# EAGLE design placa (EAGLE 7.6.0)
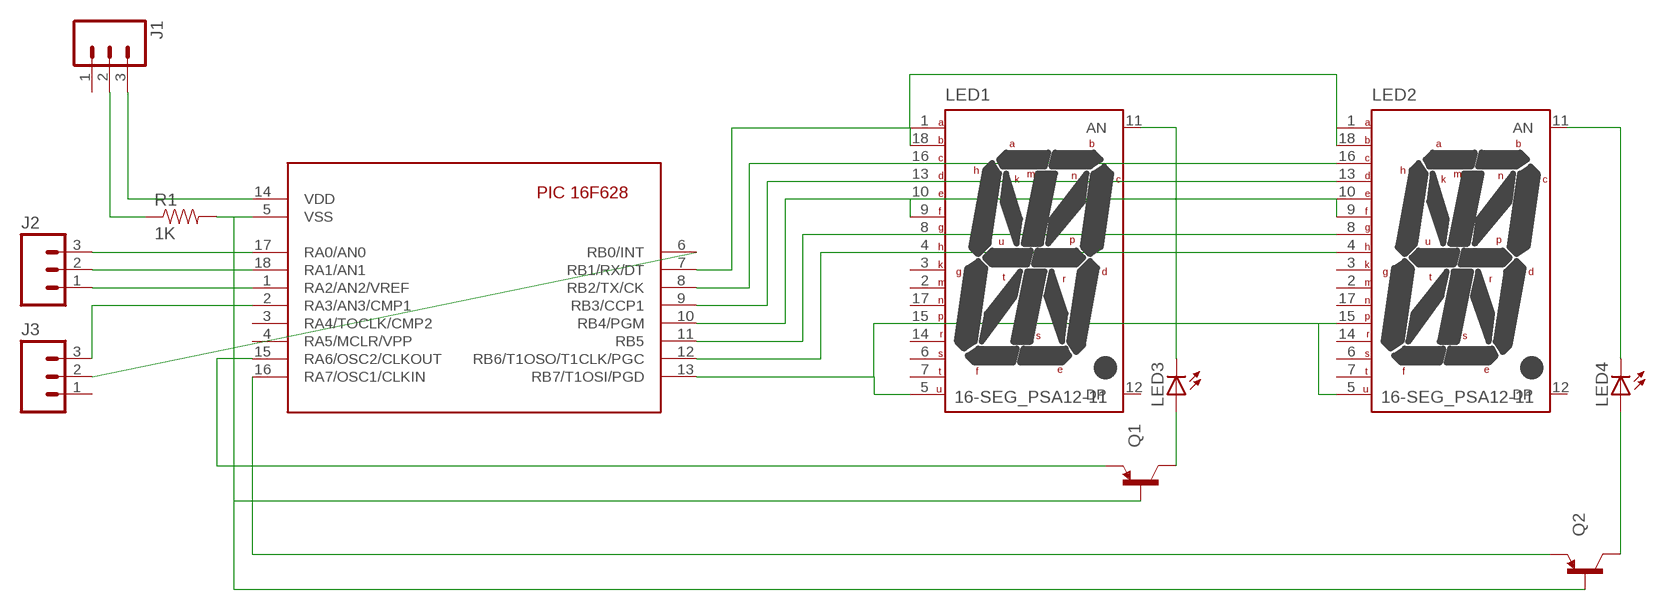
[diagram p0: schematic, sheet 1]

## Parts
J1  M03-SCREW-5MM  [SCREWTERMINAL-5MM-3]
J2  M03-SCREW-5MM  [SCREWTERMINAL-5MM-3]
J3  M03-SCREW-5MM  [SCREWTERMINAL-5MM-3]
LED1  16-SEG_PSA12-11  [PSA12-11]
LED2  16-SEG_PSA12-11  [PSA12-11]
LED3  LED3MM  [LED3MM]
LED4  LED3MM  [LED3MM]
Q1  TRANSISTOR_PNPTO92  [TO-92]
Q2  TRANSISTOR_PNPTO92  [TO-92]
R1  1K  1KOHM-1/4W-1%(PTH)  [AXIAL-0.3]
U$1  16F628  [PIC16F628-18-LEAD-PDIP]

## Nets
N$1: LED1.5(U) LED1.15(P) LED2.5(U) LED2.15(P) U$1.13(RB7/T1OSI/PGD)
N$2: LED1.1(A) LED1.18(B) LED2.1(A) LED2.18(B) U$1.7(RB1/RX/DT)
N$3: LED1.16(C) LED2.16(C) U$1.8(RB2/TX/CK)
N$4: LED1.13(D) LED2.13(D) U$1.9(RB3/CCP1)
N$5: LED1.9(F) LED1.10(E) LED2.9(F) LED2.10(E) U$1.10(RB4/PGM)
N$6: LED1.8(G) LED2.8(G) U$1.11(RB5)
N$7: LED1.4(H) LED2.4(H) U$1.12(RB6/T1OSO/T1CLK/PGC)
N$8: Q1.1(E) U$1.15(RA6/OSC2/CLKOUT)
N$9: Q2.1(E) U$1.16(RA7/OSC1/CLKIN)
N$10: J1.3 U$1.14(VDD)
N$11: J1.2 R1.P$1
N$12: Q1.2(B) Q2.2(B) R1.P$2 U$1.5(VSS)
N$13: J2.3 U$1.17(RA0/AN0)
N$14: J2.2 U$1.18(RA1/AN1)
N$15: J2.1 U$1.1(RA2/AN2/VREF)
N$16: J3.3 U$1.2(RA3/AN3/CMP1)
N$17: LED1.11(AN) LED3.K(C)
N$18: LED2.11(AN) LED4.K(C)
N$19: LED3.A Q1.3(C)
N$20: LED4.A Q2.3(C)
N$21: J3.2 U$1.6(RB0/INT)
Unconnected: J1.1 J3.1 LED1.2(M) LED1.3(K) LED1.6(S) LED1.7(T) LED1.12(DP) LED1.14(R) LED1.17(N) LED2.2(M) LED2.3(K) LED2.6(S) LED2.7(T) LED2.12(DP) LED2.14(R) LED2.17(N) U$1.3(RA4/TOCLK/CMP2) U$1.4(RA5/MCLR/VPP)

## Library data of the parts
J1-J3 = SparkFun-Connectors:M03: Header 3 Standard 3-pin 0.1" header. Use with straight break away headers (SKU : PRT-00116), right angle break away headers (PRT-00553), swiss pins (PRT-00743), machine pins (PRT-00117), and female headers (PRT-00115). Molex polarized connector foot print use with SKU : PRT-08232 with associated crimp pins and housings.; STOREFRONT_ID: PRT-08433
LED1 LED2 = display-kingbright:16-SEG_: 16 SEGMENT SINGLE DIGIT ALPHANUMERIC NUMERIC DISPLAY; OC_FARNELL: unknown; OC_NEWARK: unknown
LED3 LED4 = led:LED: LED OSRAM: - CHIPLED LG R971, LG N971, LY N971, LG Q971, LY Q971, LO R971, LY R971 LH N974, LH R974 LS Q976, LO Q976, LY Q976 LO Q996 - Hyper CHIPLED LW Q18S LB Q993, LB Q99A, LB R99A - SideLED LS A670, LO A670, LY A670, LG A670, LP A670 LB A673, LV A673, LT A673, LW A673 LH A674 LY A675 LS A676, LA A676, LO A676, LY A676, LW A676 LS A679, LY A679, LG A679 - Hyper Micro SIDELED® LS Y876, LA Y876, LO Y876, LY Y876 LT Y87S - SmartLED LW L88C, LW L88S LB L89C, LB L89S, LG L890 LS L89K, LO L89K, LY L89K LS L896, LA L896, LO L896, LY L896 - TOPLED LS T670, LO T670, LY T670, LG T670, LP T670 LSG T670, LSP T670, LSY T670, LOP T670, LYG T670 LG T671, LOG T671, LSG T671 LB T673, LV T673, LT T673, LW T673 LH T674 LS T676, LA T676, LO T676, LY T676, LB T676, LH T676, LSB T676, LW T676 LB T67C, LV T67C, LT T67C, LS T67K, LO T67K, LY T67K, LW E67C LS E67B, LA E67B, LO E67B, LY E67B, LB E67C, LV E67C, LT E67C LW T67C LS T679, LY T679, LG T679 LS T770, LO T770, LY T770, LG T770, LP T770 LB T773, LV T773, LT T773, LW T773 LH T774 LS E675, LA E675, LY E675, LS T675 LS T776, LA T776, LO T776, LY T776, LB T776 LHGB T686 LT T68C, LB T68C - Hyper Mini TOPLED® LB M676 - Mini TOPLED Santana® LG M470 LS M47K, LO M47K, LY M47K Source: http://www.osram.convergy.de LUXEON: - LUMILED® LXK2-PW12-R00, LXK2-PW12-S00, LXK2-PW14-U00, LXK2-PW14-V00 LXK2-PM12-R00, LXK2-PM12-S00, LXK2-PM14-U00 LXK2-PE12-Q00, LXK2-PE12-R00, LXK2-PE12-S00, LXK2-PE14-T00, LXK2-PE14-U00 LXK2-PB12-K00, LXK2-PB12-L00, LXK2-PB12-M00, LXK2-PB14-N00, LXK2-PB14-P00, LXK2-PB14-Q00 LXK2-PR12-L00, LXK2-PR12-M00, LXK2-PR14-Q00, LXK2-PR14-R00 LXK2-PD12-Q00, LXK2-PD12-R00, LXK2-PD12-S00 LXK2-PH12-R00, LXK2-PH12-S00 LXK2-PL12-P00, LXK2-PL12-Q00, LXK2-PL12-R00 Source: www.luxeon.com KINGBRIGHT: KA-3528ASYC Source: www.kingbright.com
Q1 Q2 = SparkFun-DiscreteSemi:TRANSISTOR_PNP: Generic PNP BJT Double check pinouts against datasheets- not all devices are the same! MMBT3906 - 40V 200mA SOT-23 (TRANS-08052) MMBT4403 - 40V 600mA SOT-23 (TRANS-09245)
R1 = SparkFun-Resistors:1KOHM-1/4W-1%(PTH): RES-12182; PROD_ID: RES-12182
U$1 = pic16f6xx-1:16F628: Microchip component PIC 16F628 Eric Magraner - eric_magraner@yahoo.fr 03/2004

## Board
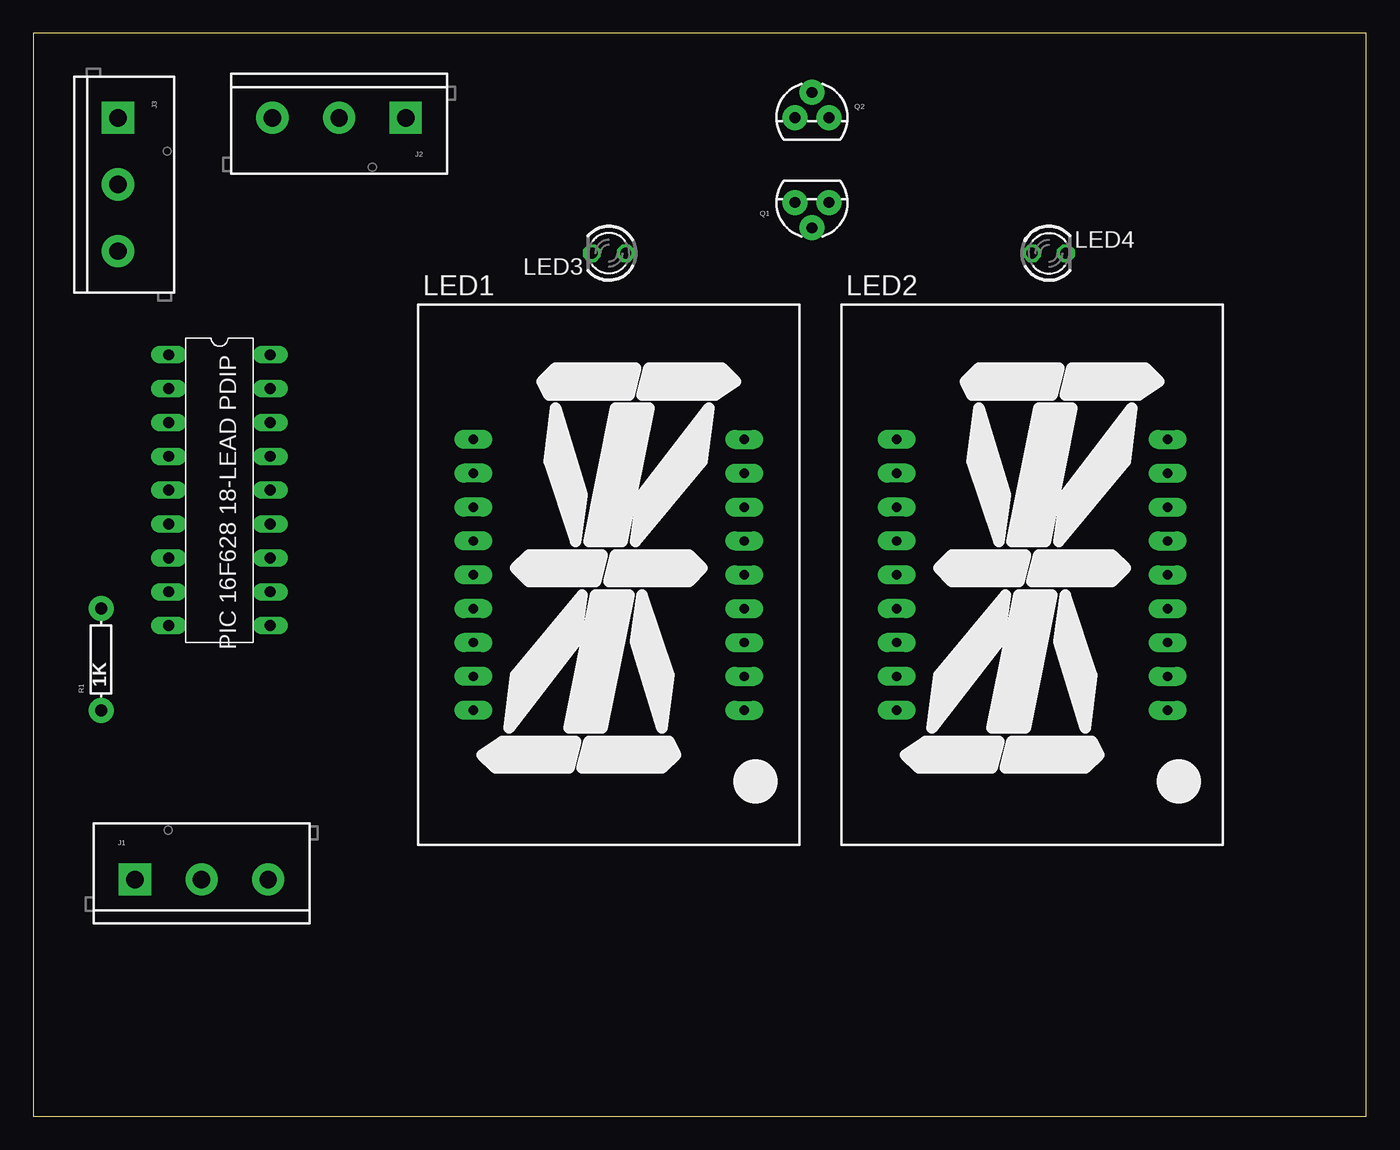
[diagram p1: board, top side]
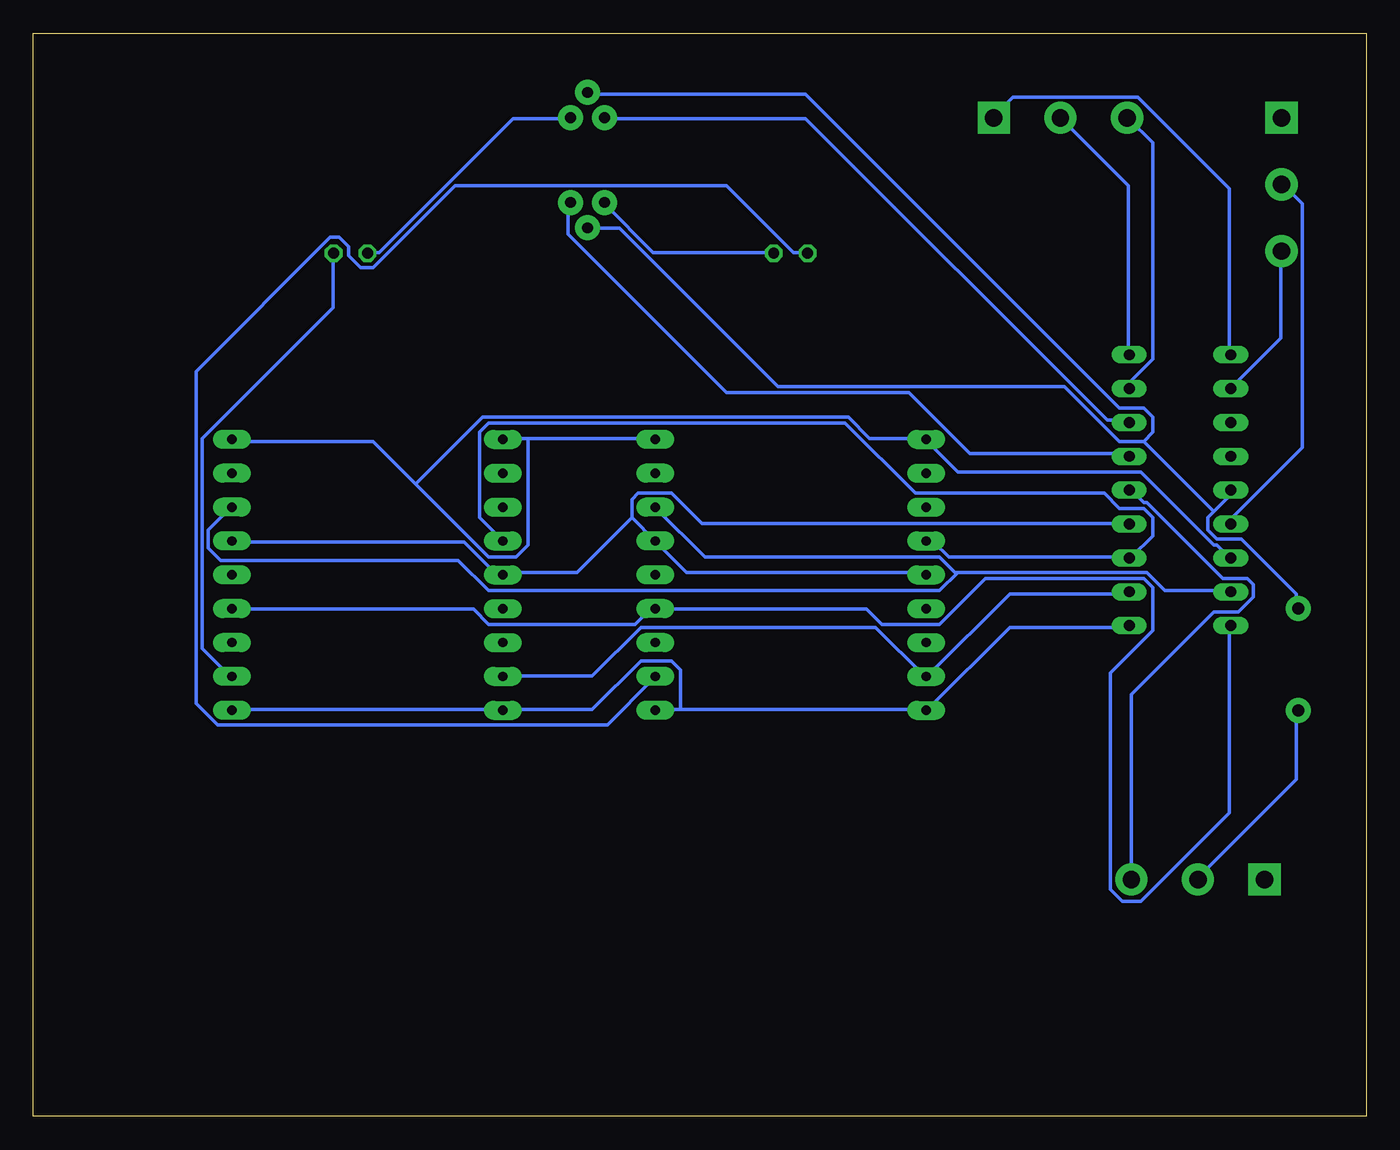
[diagram p2: board, bottom side, seen from below]

Size 100 x 81.27 mm. Coordinates in mm from the lower left corner, seen from the top.
Outline: 0,0 100,0 100,81.27 0,81.27 0,0
Copper layers (1*16): Top 0.035mm / dielectric 1.5mm / Bottom 0.035mm
Design rules "default": minimum track width 10mil, minimum drill 24mil, track to track 8mil, track to pad 8mil, pad to pad 8mil, via to via 8mil, smd to smd 8mil, copper to edge 40mil, drill to drill 8mil, minimum pad ring 10mil, minimum via ring 8mil, stop-mask expansion 4mil, vias tented up to drill 0mil, thermal gap 10mil

### Footprints (pad centres in the part's own frame; a part is rotated, then mirrored left to right if it is on the bottom)
SCREWTERMINAL-5MM-3 = drill 1.3 pad 2.413 square: 1 0,0 | drill 1.3 pad 2.413: 2 5,0; 3 10,0
PSA12-11 = drill 0.7 pad 1.422 long: 1 -10.16,10.16; 2 -10.16,7.62; 3 -10.16,5.08; 4 -10.16,2.54; 5 -10.16,0; 6 -10.16,-2.54; 7 -10.16,-5.08; 8 -10.16,-7.62; 9 -10.16,-10.16; 10 10.16,-10.16; 11 10.16,-7.62; 12 10.16,-5.08; 13 10.16,-2.54; 14 10.16,0; 15 10.16,2.54; 16 10.16,5.08; 17 10.16,7.62; 18 10.16,10.16
LED3MM = drill 0.813 octagon: A -1.27,0; K 1.27,0
TO-92 = drill 0.813 pad 1.88: 1 -1.27,0; 2 0,1.905; 3 1.27,0
AXIAL-0.3 = drill 0.9 pad 1.88: P$1 -3.81,0; P$2 3.81,0
PIC16F628-18-LEAD-PDIP = drill 0.813 long: 1 -10.16,-3.81; 2 -7.62,-3.81; 3 -5.08,-3.81; 4 -2.54,-3.81; 5 0,-3.81; 6 2.54,-3.81; 7 5.08,-3.81; 8 7.62,-3.81; 9 10.16,-3.81; 10 10.16,3.81; 11 7.62,3.81; 12 5.08,3.81; 13 2.54,3.81; 14 0,3.81; 15 -2.54,3.81; 16 -5.08,3.81; 17 -7.62,3.81; 18 -10.16,3.81

### Placement (x,y rotation side)
J1  7.62,17.78 0 top
J2  27.94,74.93 180 top
J3  6.35,74.93 270 top
LED1  43.18,40.64 0 top
LED2  74.93,40.64 0 top
LED3  43.18,64.77 180 top
LED4  76.2,64.77 0 top
Q1  58.42,68.58 180 top
Q2  58.42,74.93 0 top
R1  5.08,34.29 90 top
U$1  13.97,46.99 270 top

### Tracks (layer width: path | path; a pad name or v marks a point on that pad's centre or on a via)
N$1
  Bottom 0.254: 55.09,44.93 55.09,46.3 54.63,46.76 52.12,46.76 49.84,44.48 17.83,44.48 U$1.13 | 55.09,44.93 LED1.15 50.98,40.82 33.15,40.82 LED1.5 | 55.09,44.93 59.21,40.82 64.69,40.82 LED2.5 64.92,40.82 65.38,40.82 67.67,43.1 85.04,43.1 LED2.15
N$2
  Bottom 0.254: U$1.7 10.29,41.96 11.2,42.88 11.43,42.88 16.92,48.36 30.63,48.36 32.92,50.65 LED1.1 33.15,50.88 37.26,50.88 38.86,52.48 66.29,52.48 71.32,47.45 | 62.87,50.88 64.69,50.88 LED2.1 | 62.87,50.88 53.49,50.88 LED1.18 | 71.32,47.45 65.84,41.96 63.78,41.96 62.87,42.88 62.87,50.88 | 71.32,47.45 74.52,50.65 85.04,50.65 LED2.18
N$3
  Bottom 0.254: 30.63,40.82 30.86,40.82 32,41.96 49.61,41.96 53.26,45.62 LED1.16 | 30.63,40.82 16.46,40.82 15.09,39.45 10.29,39.45 U$1.8 | 30.63,40.82 32,39.45 65.84,39.45 68.12,41.73 85.95,41.73 86.87,42.65 86.87,44.02 85.27,45.62 LED2.16
N$4
  Bottom 0.254: U$1.9 10.29,36.7 10.29,22.76 16.92,16.13 18.29,16.13 19.2,17.04 19.2,33.27 16,36.47 16,39.68 16.69,40.36 28.57,40.36 32,36.93 36.35,36.93 37.49,38.08 53.26,38.08 LED1.13 53.49,38.3 54.86,36.93 65.84,36.93 66.98,38.08 85.04,38.08 LED2.13
N$5
  Bottom 0.254: U$1.10 17.83,36.7 26.75,36.7 32.92,30.53 LED1.9 33.15,30.53 51.44,30.53 | 51.44,30.53 53.26,30.53 LED1.10 | 51.44,30.53 51.44,33.5 52.12,34.19 54.41,34.19 58.06,30.53 64.69,30.53 LED2.9 64.92,30.53 85.04,30.53 LED2.10
N$6
  Bottom 0.254: U$1.11 17.83,39.22 26.75,39.22 32.92,33.05 LED1.8 33.15,33.05 36.8,36.7 54.41,36.7 58.06,33.05 64.69,33.05 LED2.8
N$7
  Bottom 0.254: LED1.4 32.92,43.1 32.46,43.1 31.32,41.96 17.83,41.96 U$1.12 17.6,41.96 16,43.56 16,44.93 16.69,45.62 18.52,45.62 19.66,46.76 33.83,46.76 39.09,52.02 65.84,52.02 66.52,51.33 66.52,44.93 LED2.4
N$8
  Bottom 0.254: U$1.15 17.83,49.73 29.72,49.73 34.29,54.3 48.01,54.3 59.89,66.19 59.89,68.48 Q1.1
N$9
  Bottom 0.254: U$1.16 17.83,52.25 19.43,52.25 42.06,74.88 57.15,74.88 Q2.1
N$10
  Bottom 0.254: U$1.14 17.6,46.99 16.69,46.08 16.46,46.08 10.74,40.36 8.91,40.36 8.46,39.9 8.46,38.99 9.6,37.85 11.43,37.85 17.6,31.67 17.6,17.96 J1.3
N$11
  Bottom 0.254: R1.P$1 5.26,30.3 5.26,25.27 12.57,17.96 J1.2
N$12
  Bottom 0.254: 11.43,45.39 11.89,44.93 11.89,44.02 11.2,43.33 9.37,43.33 5.26,39.22 5.26,38.3 R1.P$2 | 11.43,45.39 10.29,46.53 10.29,46.99 U$1.5 | 16.69,50.65 18.52,50.65 22.63,54.76 44.12,54.76 56.01,66.65 58.29,66.65 Q1.2 | 11.43,45.39 16.69,50.65 | 16.69,50.65 16,51.33 16,52.48 16.69,53.16 18.52,53.16 42.06,76.71 58.29,76.71 Q2.2
N$13
  Bottom 0.254: U$1.17 17.6,54.76 17.6,55.22 16,56.82 16,73.05 17.83,74.88 J2.3
N$14
  Bottom 0.254: U$1.18 17.83,57.28 17.83,69.85 22.86,74.88 J2.2
N$15
  Bottom 0.254: U$1.1 10.29,57.28 10.29,69.62 17.14,76.48 26.52,76.48 27.89,75.11 J2.1
N$16
  Bottom 0.254: U$1.2 10.06,54.76 6.4,58.42 6.4,64.82 J3.3
N$17
  Bottom 0.254: LED3.K 42.06,64.82 42.98,64.82 48.01,69.85 68.35,69.85 74.52,63.68 75.44,63.68 76.35,64.59 76.35,65.28 77.04,65.96 77.72,65.96 87.78,55.91 87.78,30.99 86.18,29.39 56.92,29.39 53.49,32.82 LED1.11
N$18
  Bottom 0.254: LED4.K 77.5,64.59 77.5,60.71 87.33,50.88 87.33,35.1 85.27,33.05 LED2.11
N$19
  Bottom 0.254: LED3.A 44.58,64.82 53.49,64.82 57.15,68.48 Q1.3
N$20
  Bottom 0.254: LED4.A 74.75,64.82 74.07,64.82 64.01,74.88 59.89,74.88 Q2.3
N$21
  Bottom 0.254: U$1.6 10.06,44.48 10.06,44.93 4.8,50.19 4.8,68.48 6.17,69.85 J3.2